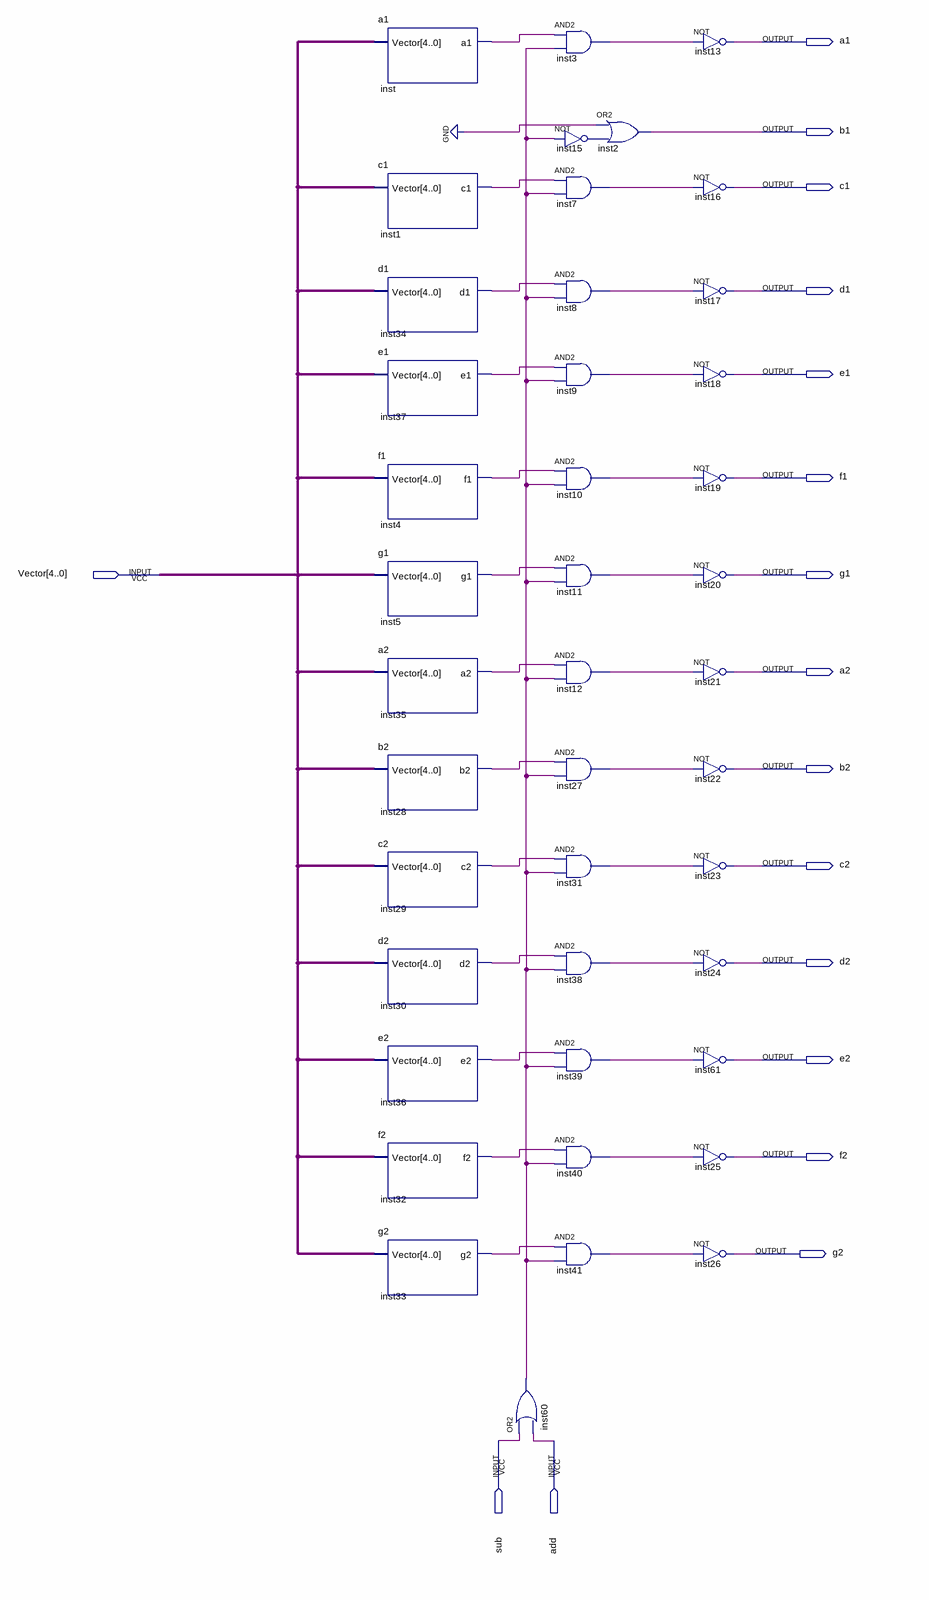
[diagram p0: schematic sheet]
// Quartus schematic decodificador_da_dor.bdf as structural Verilog: 42 symbols, 17 pins
module decodificador_da_dor (
  input  [4:0] Vector,
  input  sub,
  input  add,
  output a1,
  output b1,
  output c1,
  output d1,
  output e1,
  output f1,
  output g1,
  output a2,
  output b2,
  output c2,
  output d2,
  output e2,
  output f2,
  output g2
);

  wire inst1_c1, inst3_out, inst4_f1, inst5_g1, inst7_out, inst8_out, inst9_out, inst10_out, inst11_out,
       inst12_out, inst15_out, inst27_out, inst28_b2, inst29_c2, inst30_d2, inst31_out, inst32_f2, inst33_g2,
       inst34_d1, inst35_a2, inst36_e2, inst37_e1, inst38_out, inst39_out, inst40_out, inst41_out,
       inst60_out, inst_a1;

  a1 inst (.Vector(Vector), .a1(inst_a1));
  c1 inst1 (.Vector(Vector), .c1(inst1_c1));
  d1 inst34 (.Vector(Vector), .d1(inst34_d1));
  e1 inst37 (.Vector(Vector), .e1(inst37_e1));
  f1 inst4 (.Vector(Vector), .f1(inst4_f1));
  g1 inst5 (.Vector(Vector), .g1(inst5_g1));
  a2 inst35 (.Vector(Vector), .a2(inst35_a2));
  b2 inst28 (.Vector(Vector), .b2(inst28_b2));
  c2 inst29 (.Vector(Vector), .c2(inst29_c2));
  d2 inst30 (.Vector(Vector), .d2(inst30_d2));
  e2 inst36 (.Vector(Vector), .e2(inst36_e2));
  f2 inst32 (.Vector(Vector), .f2(inst32_f2));
  g2 inst33 (.Vector(Vector), .g2(inst33_g2));
  or inst60 (inst60_out, sub, add);
  and inst3 (inst3_out, inst_a1, inst60_out);
  not inst15 (inst15_out, inst60_out);
  and inst7 (inst7_out, inst1_c1, inst60_out);
  and inst8 (inst8_out, inst34_d1, inst60_out);
  and inst9 (inst9_out, inst37_e1, inst60_out);
  and inst10 (inst10_out, inst4_f1, inst60_out);
  and inst11 (inst11_out, inst5_g1, inst60_out);
  and inst12 (inst12_out, inst35_a2, inst60_out);
  and inst27 (inst27_out, inst28_b2, inst60_out);
  and inst31 (inst31_out, inst29_c2, inst60_out);
  and inst38 (inst38_out, inst30_d2, inst60_out);
  and inst39 (inst39_out, inst36_e2, inst60_out);
  and inst40 (inst40_out, inst32_f2, inst60_out);
  and inst41 (inst41_out, inst33_g2, inst60_out);
  or inst2 (b1, 1'b0, inst15_out);
  not inst13 (a1, inst3_out);
  not inst16 (c1, inst7_out);
  not inst17 (d1, inst8_out);
  not inst18 (e1, inst9_out);
  not inst19 (f1, inst10_out);
  not inst20 (g1, inst11_out);
  not inst21 (a2, inst12_out);
  not inst22 (b2, inst27_out);
  not inst23 (c2, inst31_out);
  not inst24 (d2, inst38_out);
  not inst61 (e2, inst39_out);
  not inst25 (f2, inst40_out);
  not inst26 (g2, inst41_out);
endmodule
